# Altium project PCB_Project.PrjPcb
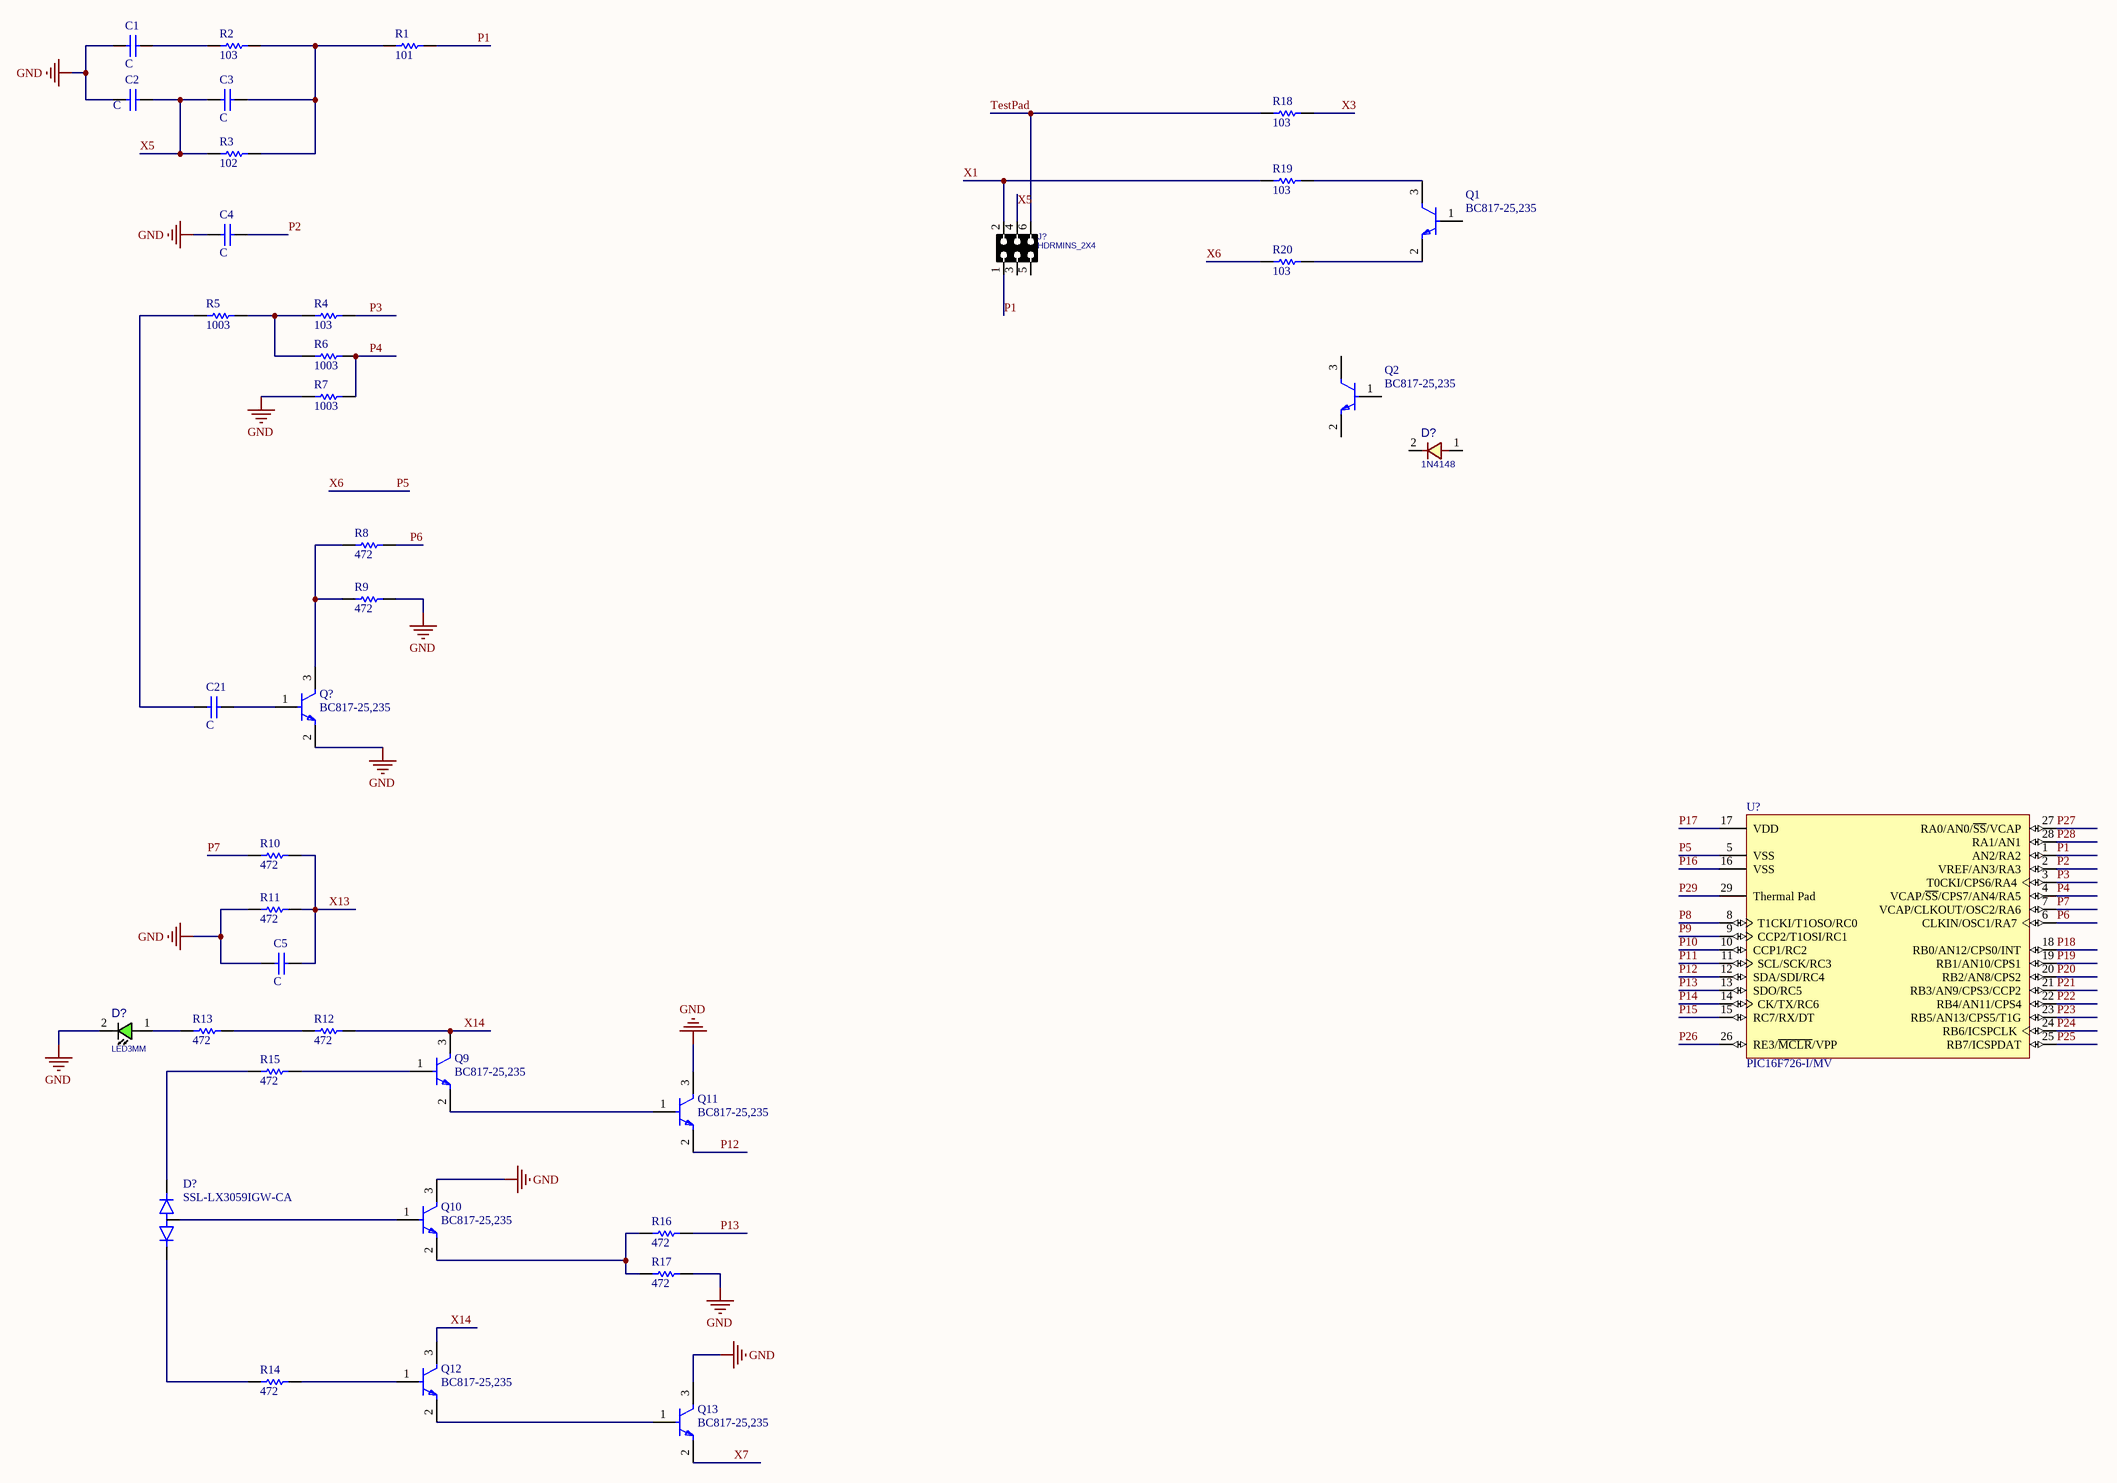
[diagram p0: Sheet1.SchDoc]
1 sheet, 39 parts. Net scope: global (net labels, ports and power ports of the same name join across sheets).

## Sheet Sheet1.SchDoc
size 635 x 304 mm; SheetNumber: 1; SheetTotal: 1

### Parts
(Parts that share a designator on the sheet are numbered #1, #2 ... from top to bottom, then left to right.)
C1  C  [CAPC1608X87X35LL15T15]
C2  C  [CAPC1608X87X35LL15T15]
C3  C  [CAPC1608X87X35LL15T15]
C4  C  [CAPC1608X87X35LL15T15]
C5  C  [CAPC1608X87X35LL15T15]
C21  C  [CAPC1608X87X35LL15T15]
D?#1  1N4148  [D_SOD80]
D?#2  LED3MM  [LED3MM]
D?#3  SSL-LX3059IGW-CA  [LED_SSL-LX3059IGW-CA]
J?  HDRMINS_2X4  [HDRMINIS_F_2X3]
Q1  BC817-25,235  [FP-SOT23-IPC_C]
Q2  BC817-25,235  [FP-SOT23-IPC_C]
Q9  BC817-25,235  [FP-SOT23-IPC_C]
Q10  BC817-25,235  [FP-SOT23-IPC_C]
Q11  BC817-25,235  [FP-SOT23-IPC_C]
Q12  BC817-25,235  [FP-SOT23-IPC_C]
Q13  BC817-25,235  [FP-SOT23-IPC_C]
Q?  BC817-25,235  [FP-SOT23-IPC_C]
R1  101  [RESC1608X55X25ML10T15]
R2  103  [RESC1608X55X25ML10T15]
R3  102  [RESC1608X55X25ML10T15]
R4  103  [RESC1608X55X25ML10T15]
R5  1003  [RESC1608X55X25ML10T15]
R6  1003  [RESC1608X55X25ML10T15]
R7  1003  [RESC1608X55X25ML10T15]
R8  472  [RESC1608X55X25ML10T15]
R9  472  [RESC1608X55X25ML10T15]
R10  472  [RESC1608X55X25ML10T15]
R11  472  [RESC1608X55X25ML10T15]
R12  472  [RESC1608X55X25ML10T15]
R13  472  [RESC1608X55X25ML10T15]
R14  472  [RESC1608X55X25ML10T15]
R15  472  [RESC1608X55X25ML10T15]
R16  472  [RESC1608X55X25ML10T15]
R17  472  [RESC1608X55X25ML10T15]
R18  103  [RESC1608X55X25ML10T15]
R19  103  [RESC1608X55X25ML10T15]
R20  103  [RESC1608X55X25ML10T15]
U?  PIC16F726-I/MV  [UQFN-MV28_M]

### Nets
GND: C1.2 C2.2 C4.2 C5.2 D?#2.2(CATHODE) Q10.3(C) Q11.3(C) Q13.3(C) Q?.2(E) R7.1 R9.2 R11.1 R17.2
P1: J?.1 R1.1 U?.1(AN2/RA2)
P2: C4.1 U?.2(VREF/AN3/RA3)
P3: R4.2 U?.3(T0CKI/CPS6/RA4)
P4: R6.2 R7.2 U?.4(VCAP/~{SS}/CPS7/AN4/RA5)
P5: R20.1 U?.5(VSS)  [also labelled X6]
P6: R8.2 U?.6(CLKIN/OSC1/RA7)
P7: R10.1 U?.7(VCAP/CLKOUT/OSC2/RA6)
P8: U?.8(T1CKI/T1OSO/RC0)
P9: U?.9(CCP2/T1OSI/RC1)
P10: U?.10(CCP1/RC2)
P11: U?.11(SCL/SCK/RC3)
P12: Q11.2(E) U?.12(SDA/SDI/RC4)
P13: R16.2 U?.13(SDO/RC5)
P14: U?.14(CK/TX/RC6)
P15: U?.15(RC7/RX/DT)
P16: U?.16(VSS)
P17: U?.17(VDD)
P18: U?.18(RB0/AN12/CPS0/INT)
P19: U?.19(RB1/AN10/CPS1)
P20: U?.20(RB2/AN8/CPS2)
P21: U?.21(RB3/AN9/CPS3/CCP2)
P22: U?.22(RB4/AN11/CPS4)
P23: U?.23(RB5/AN13/CPS5/T1G)
P24: U?.24(RB6/ICSPCLK)
P25: U?.25(RB7/ICSPDAT)
P26: U?.26(RE3/~{MCLR}/VPP)
P27: U?.27(RA0/AN0/~{SS}/VCAP)
P28: U?.28(RA1/AN1)
P29: U?.29(Thermal_Pad)
TestPad: J?.6 R18.1
X1: J?.2 R19.1
X3: R18.2
X5: C2.1 C3.2 J?.4 R3.2
X7: Q13.2(E)
X13: C5.1 R10.2 R11.2
X14: Q9.3(C) Q12.3(C) R12.2
NetC1_1: C1.1 R2.2
NetC3_1: C3.1 R1.2 R2.1 R3.1
NetC21_1: C21.1 Q?.1(B)
NetC21_2: C21.2 R5.1
NetD?#2_1: D?#2.1(ANODE) R13.1
NetD?#3_1: D?#3.1(RED_C) R15.1
NetD?#3_2: D?#3.2(COMMON_A) Q10.1(B)
NetD?#3_3: D?#3.3(GREEN_C) R14.1
NetQ1_2: Q1.2(E) R20.2
NetQ1_3: Q1.3(C) R19.2
NetQ9_1: Q9.1(B) R15.2
NetQ9_2: Q9.2(E) Q11.1(B)
NetQ10_2: Q10.2(E) R16.1 R17.1
NetQ12_1: Q12.1(B) R14.2
NetQ12_2: Q12.2(E) Q13.1(B)
NetQ?_3: Q?.3(C) R8.1 R9.1
NetR4_1: R4.1 R5.2 R6.1
NetR12_1: R12.1 R13.2

Not connected (* = marked no-connect by the designer): D?#1 1 2; J? 3 5; Q1 1(B); Q2 1(B) 2(E) 3(C)

### Library data of the parts
C1-C5 C21 = CMP-2006-03741-1: Part Number: C0603S102K5RACTU; Manufacturer: Kemet
D?#1 = DIODE_SMD_1N4148_SOD80: DIODE, FAST SWTICHING, 0.3A, 0.5W; DESC: DESCRIPTION; PARAM: 75V; PARAM2: 300mA, 0.5W; MANF: MANF; ASSEMBLY: ASSEMBLY; PRICE: PRICE; MANF_P#: 1N4148; VALUE: 1N4148
D?#2 = LED_THD_3MM: LED, THD, 3MM, GREEN; DESC: DESCRIPTION; MANF_P#: MANF_PART#; PARAM2: 2.2V; MANF: MANF; ASSEMBLY: ASSEMBLY; PRICE: PRICE; VALUE: LED3MM
D?#3 = SSL-LX3059IGW-CA: Green, Red LED Indication - Discrete 2.2V Green, 2V Red Radial - 3 Leads; MF: Lumex Opto/Components Inc.; Availability: In Stock; Value: *; Price: None; Check_prices: https://www.snapeda.com/parts/SSL-LX3059IGW-CA/Lumex+Opto%252FComponents+Inc./view-part/?ref=eda; Purchase-URL: https://pricing.snapeda.com/search/part/SSL-LX3059IGW-CA/?ref=eda; SnapEDA_Link: https://www.snapeda.com/parts/SSL-LX3059IGW-CA/Lumex+Opto%252FComponents+Inc./view-part/?ref=snap; MP: SSL-LX3059IGW-CA; Package: Radial-3 Lumex
J? = HDRMINIS_F_2X3: CONN, HEADER, Female, pitch: 1.27mm,; MANF_P#: MANF_PART#; MANF: MANF; VALUE: HDRMINS_2X4
Q1 Q2 Q9-Q13 Q? = CMP-14406-000047-1: TRANS NPN 45V 500MA TO236AB; RoHS Compliant: Yes
R1-R20 = CMP-2000-04177-1: Part Number: RC0603FR-1020KL; Manufacturer: Yageo
U? = CMP-0115-00374-1: Flash-Based, 8-Bit CMOS Microcontroller, 8K (x14-Bit words) Program Memory, 368 Bytes Data Memory, 25 I/O pins, 28-Pin UQFN, Standard VDD Range, Industrial Temperature; DatasheetVersion: revE, Oct-2009; PackageVersion: revBB, Aug-2009; PackageReference: UQFN-MV28; PackageDescription: 28-Lead Plastic Ultra Thin Quad Flat, No Lead Package (MV) - 4x4x0.5 mm Body [UQFN]